# Altium project equalizer_project.PrjPcb
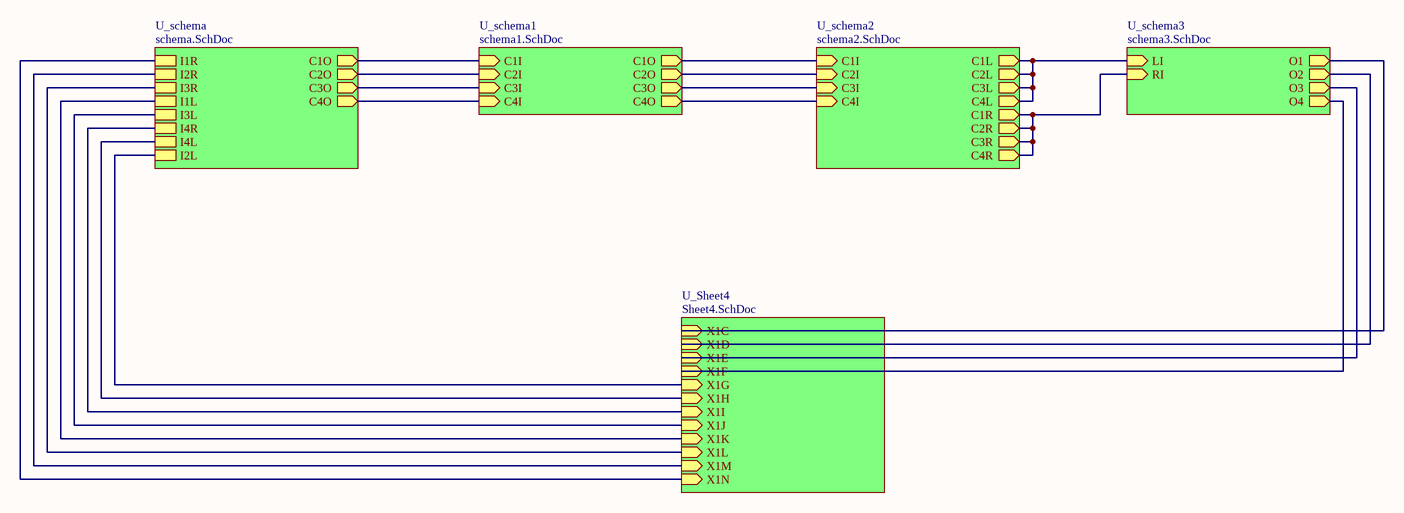
[diagram p0: top_sheet.SchDoc]
6 sheets, 224 parts. Net scope: hierarchical (ports join the sheet entries above them; power ports are global).
Board file: eq.PcbDoc
Sheets:
  top_sheet.SchDoc
    U_Sheet4 = Sheet4.SchDoc
    U_schema = schema.SchDoc
    U_schema1 = schema1.SchDoc
    U_schema2 = schema2.SchDoc
    U_schema3 = schema3.SchDoc

## Sheet top_sheet.SchDoc
size A4

### Sub-sheets
U_schema = schema.SchDoc: C1O (out), C2O (out), C3O (out), C4O (out), I1R, I2R, I3R, I1L, I3L, I4R, I4L, I2L
U_schema1 = schema1.SchDoc: C1I (in), C2I (in), C3I (in), C4I (in), C1O (out), C2O (out), C4O (out), C3O (out)
U_schema2 = schema2.SchDoc: C1I (in), C2I (in), C3I (in), C4I (in), C1L (out), C1R (out), C2L (out), C2R (out), C3L (out), C3R (out), C4L (out), C4R (out)
U_schema3 = schema3.SchDoc: LI (in), RI (in), O1 (out), O2 (out), O3 (out), O4 (out)
U_Sheet4 = Sheet4.SchDoc: X1C (in), X1D (in), X1E (in), X1F (in), X1G (in), X1H (in), X1I (in), X1J (in), X1K (in), X1L (in), X1M (in), X1N (in)

### Nets
Net2514-_3: sheet U_Sheet4/X1C, sheet U_schema3/O1
Net2514-_H4: sheet U_Sheet4/X1D, sheet U_schema3/O2
Net2514-_H5: sheet U_Sheet4/X1E, sheet U_schema3/O3
Net2514-_H6: sheet U_Sheet4/X1F, sheet U_schema3/O4
Net2514-_H7: sheet U_Sheet4/X1G, sheet U_schema/I2L
Net2514-_H8: sheet U_Sheet4/X1H, sheet U_schema/I4L
Net2514-_H9: sheet U_Sheet4/X1I, sheet U_schema/I4R
Net2514-_H10: sheet U_Sheet4/X1J, sheet U_schema/I3L
Net2514-_H11: sheet U_Sheet4/X1K, sheet U_schema/I1L
Net2514-_H12: sheet U_Sheet4/X1L, sheet U_schema/I3R
Net2514-_H13: sheet U_Sheet4/X1M, sheet U_schema/I2R
Net2514-_H14: sheet U_Sheet4/X1N, sheet U_schema/I1R
NetR53_2: sheet U_schema/C1O, sheet U_schema1/C1I
NetR54_2: sheet U_schema/C2O, sheet U_schema1/C2I
NetR55_2: sheet U_schema/C3O, sheet U_schema1/C3I
NetR56_2: sheet U_schema/C4O, sheet U_schema1/C4I
NetR85_2: sheet U_schema1/C1O, sheet U_schema2/C1I
NetR88_2: sheet U_schema1/C2O, sheet U_schema2/C2I
NetR91_2: sheet U_schema1/C3O, sheet U_schema2/C3I
NetR94_2: sheet U_schema1/C4O, sheet U_schema2/C4I
NetR117_2: sheet U_schema2/C1L, sheet U_schema2/C2L, sheet U_schema2/C3L, sheet U_schema2/C4L, sheet U_schema3/LI
NetR118_2: sheet U_schema2/C1R, sheet U_schema2/C2R, sheet U_schema2/C3R, sheet U_schema2/C4R, sheet U_schema3/RI

## Sheet Sheet4.SchDoc
size A4
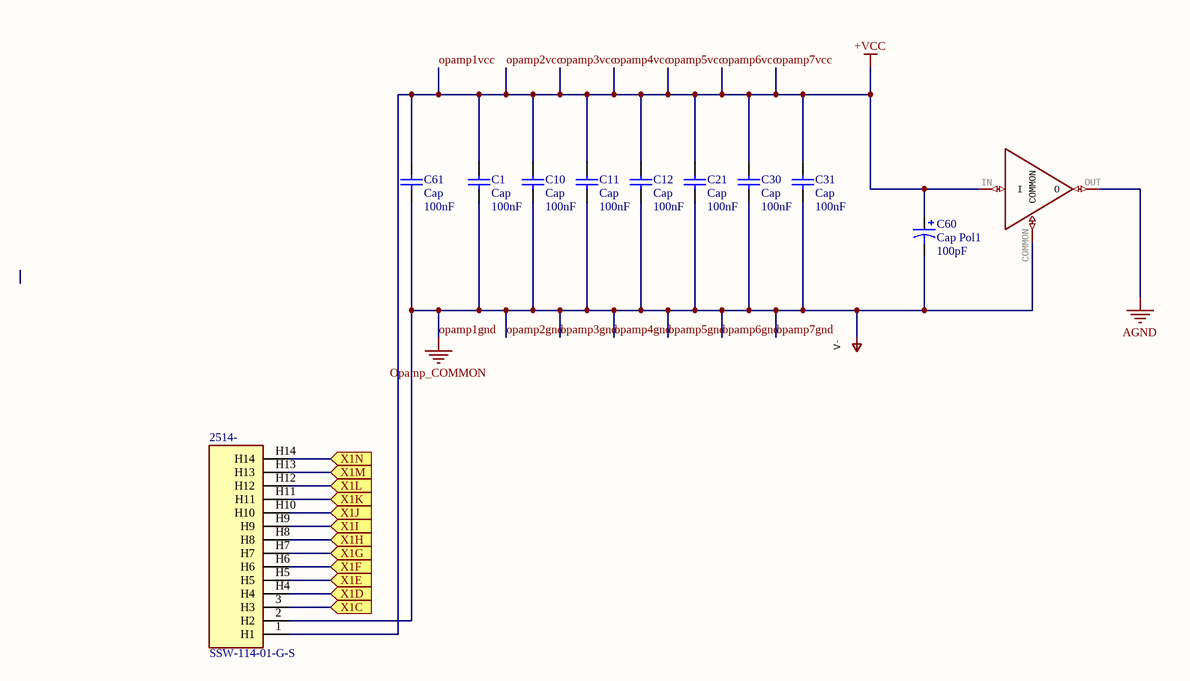
[diagram p1: Sheet4.SchDoc]

### Parts
2514-  SSW-114-01-G-S  [SHDR14W79P0X254_1X14_3607X241X851P]
C1  Cap  value 100nF  [SMD_CAPACITOR]
C10  Cap  value 100nF  [SMD_CAPACITOR]
C11  Cap  value 100nF  [SMD_CAPACITOR]
C12  Cap  value 100nF  [SMD_CAPACITOR]
C21  Cap  value 100nF  [SMD_CAPACITOR]
C30  Cap  value 100nF  [SMD_CAPACITOR]
C31  Cap  value 100nF  [SMD_CAPACITOR]
C60  Cap Pol1  value 100pF  [SMD_POLAR_CAPACITOR]
C61  Cap  value 100nF  [SMD_CAPACITOR]
P-25  V-
U?  TLE2426  [SOIC127P600X175-8N]  (value not drawn)

### Ports
X1C (in), X1D (in), X1E (in), X1F (in), X1G (in), X1H (in), X1I (in), X1J (in), X1K (in), X1L (in), X1M (in), X1N (in)

### Nets
AGND: U?.OUT(O)
opamp1gnd: 2514-.2(H2) C1.1 C10.1 C11.1 C12.1 C21.1 C30.1 C31.1 C60.2 C61.1 P-25.?1(V-) U?.COMMON  [also labelled opamp2gnd, opamp3gnd, opamp4gnd, opamp5gnd, opamp6gnd, opamp7gnd, Opamp_COMMON]
opamp1vcc: 2514-.1(H1) C1.2 C10.2 C11.2 C12.2 C21.2 C30.2 C31.2 C60.1 C61.2 U?.IN(I)  [also labelled +VCC, opamp2vcc, opamp3vcc, opamp4vcc, opamp5vcc, opamp6vcc, opamp7vcc]
Net2514-_3: 2514-.3(H3) ; port X1C
Net2514-_H4: 2514-.H4 ; port X1D
Net2514-_H5: 2514-.H5 ; port X1E
Net2514-_H6: 2514-.H6 ; port X1F
Net2514-_H7: 2514-.H7 ; port X1G
Net2514-_H8: 2514-.H8 ; port X1H
Net2514-_H9: 2514-.H9 ; port X1I
Net2514-_H10: 2514-.H10 ; port X1J
Net2514-_H11: 2514-.H11 ; port X1K
Net2514-_H12: 2514-.H12 ; port X1L
Net2514-_H13: 2514-.H13 ; port X1M
Net2514-_H14: 2514-.H14 ; port X1N

### Library data of the parts
2514- = SSW-114-01-G-S: Capacitor; Manufacturer_Name: SAMTEC; Datasheet Link: http://suddendocs.samtec.com/prints/ssw-1xx-xx-xxx-x-xx-xxx-xx-mkt.pdf; Height: 8.51mm; Manufacturer_Part_Number: SSW-114-01-G-S
C1 C10-C12 C21 C30 C31 C61 = Cap: Capacitor; Published: 8-Jun-2000; LatestRevisionDate: 17-Jul-2002; LatestRevisionNote: Re-released for DXP Platform.; PackageReference: RAD-0.3; Publisher: Altium Limited; PackageDescription: Radial Cap, Thru-Hole; 2 Leads; 0.3 in Pin Spacing
C60 = Cap Pol1: Polarized Capacitor (Radial); Published: 8-Jun-2000; LatestRevisionDate: 17-Jul-2002; LatestRevisionNote: Re-released for DXP Platform.; PackageReference: RB7.6-15; Publisher: Altium Limited; PackageDescription: Polarized Capacitor (Radial); 2 Leads
P-25 = V-: SUPPLY SYMBOL; GateName_1: 1; SymbolName_1: V-; LibraryName: supply1; DeviceSetName: V-
U? = TLE2426: GateName_1: G$1; SymbolName_1: TLE2426; LibraryName: MyLib_SD; DeviceSetName: TLE2426

## Sheet schema.SchDoc
size A3
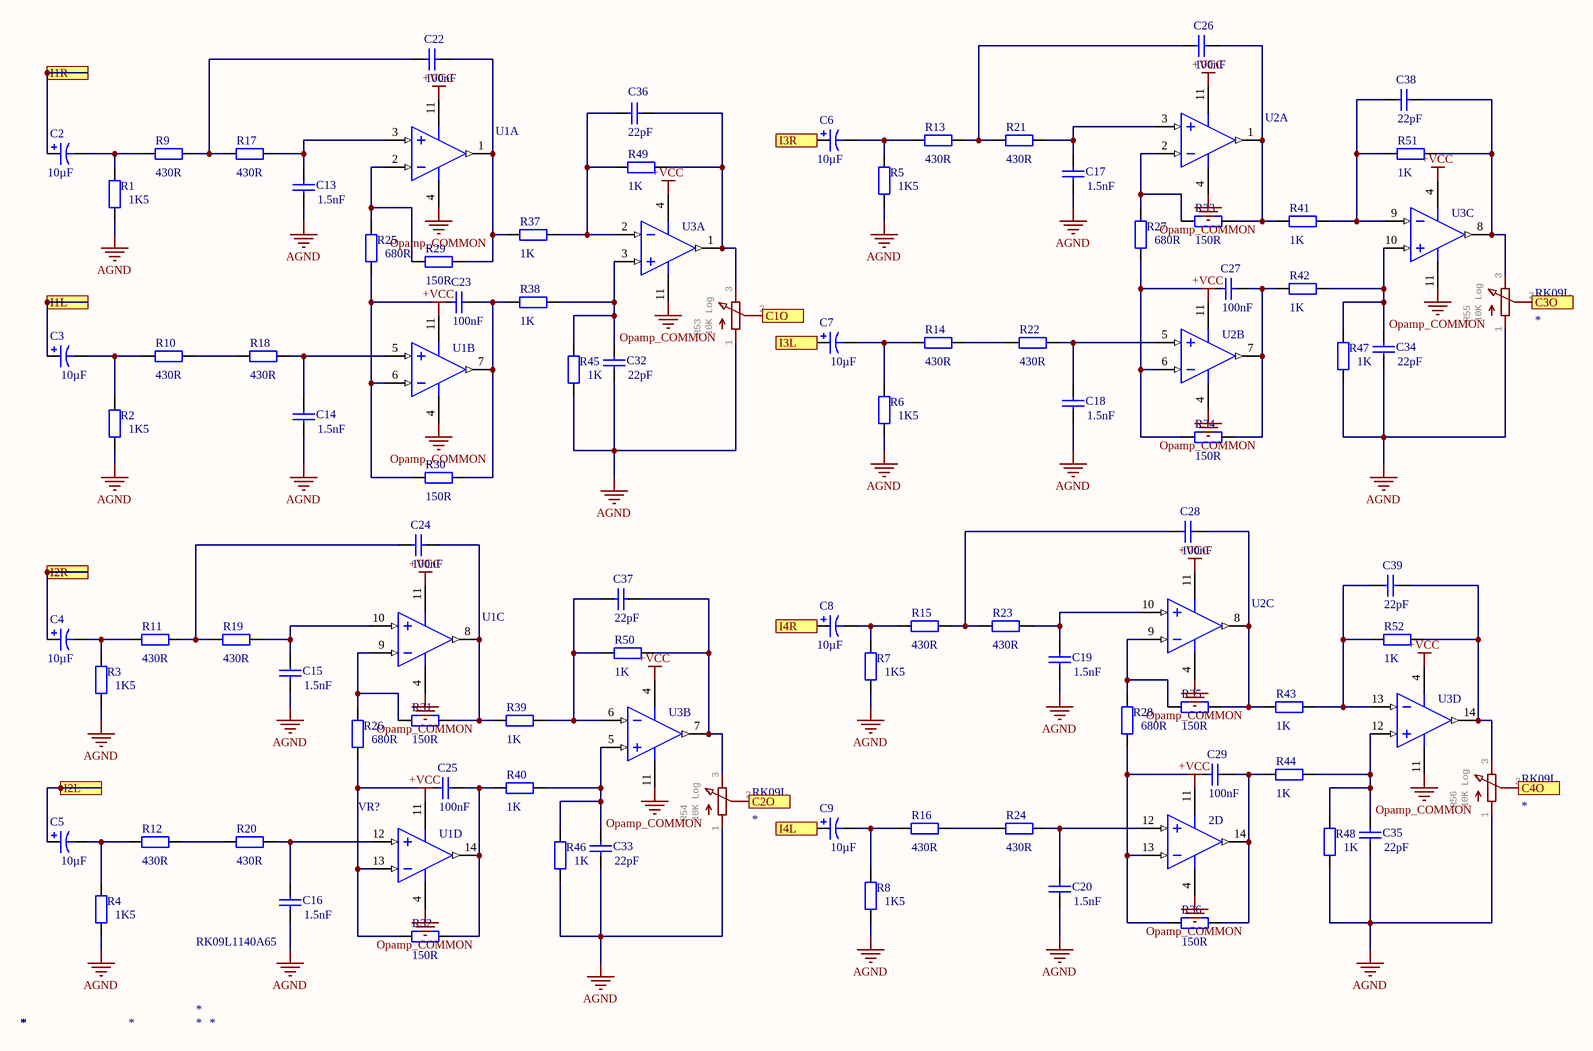
[diagram p2: schema.SchDoc]

### Parts
(Parts that share a designator on the sheet are numbered #1, #2 ... from top to bottom, then left to right.)
2  OPA1664AIDR  [OPA1664AIDR]  (value not drawn)  (part D of 4)
C2  value 10µF  [SMD_POLAR_CAPACITOR]  (hidden comment: Cap Pol1)
C3  value 10µF  [SMD_POLAR_CAPACITOR]  (hidden comment: Cap Pol1)
C4  value 10µF  [SMD_POLAR_CAPACITOR]  (hidden comment: Cap Pol1)
C5  value 10µF  [SMD_POLAR_CAPACITOR]  (hidden comment: Cap Pol1)
C6  value 10µF  [SMD_POLAR_CAPACITOR]  (hidden comment: Cap Pol1)
C7  value 10µF  [SMD_POLAR_CAPACITOR]  (hidden comment: Cap Pol1)
C8  value 10µF  [SMD_POLAR_CAPACITOR]  (hidden comment: Cap Pol1)
C9  value 10µF  [SMD_POLAR_CAPACITOR]  (hidden comment: Cap Pol1)
C13  value 1.5nF  [SMD_CAPACITOR]  (hidden comment: Cap)
C14  value 1.5nF  [SMD_CAPACITOR]  (hidden comment: Cap)
C15  value 1.5nF  [SMD_CAPACITOR]  (hidden comment: Cap)
C16  value 1.5nF  [SMD_CAPACITOR]  (hidden comment: Cap)
C17  value 1.5nF  [SMD_CAPACITOR]  (hidden comment: Cap)
C18  value 1.5nF  [SMD_CAPACITOR]  (hidden comment: Cap)
C19  value 1.5nF  [SMD_CAPACITOR]  (hidden comment: Cap)
C20  value 1.5nF  [SMD_CAPACITOR]  (hidden comment: Cap)
C22  value 100nF  [SMD_CAPACITOR]  (hidden comment: Cap)
C23  value 100nF  [SMD_CAPACITOR]  (hidden comment: Cap)
C24  value 100nF  [SMD_CAPACITOR]  (hidden comment: Cap)
C25  value 100nF  [SMD_CAPACITOR]  (hidden comment: Cap)
C26  value 100nF  [SMD_CAPACITOR]  (hidden comment: Cap)
C27  value 100nF  [SMD_CAPACITOR]  (hidden comment: Cap)
C28  value 100nF  [SMD_CAPACITOR]  (hidden comment: Cap)
C29  value 100nF  [SMD_CAPACITOR]  (hidden comment: Cap)
C32  value 22pF  [SMD_CAPACITOR]  (hidden comment: Cap)
C33  value 22pF  [SMD_CAPACITOR]  (hidden comment: Cap)
C34  value 22pF  [SMD_CAPACITOR]  (hidden comment: Cap)
C35  value 22pF  [SMD_CAPACITOR]  (hidden comment: Cap)
C36  value 22pF  [SMD_CAPACITOR]  (hidden comment: Cap)
C37  value 22pF  [SMD_CAPACITOR]  (hidden comment: Cap)
C38  value 22pF  [SMD_CAPACITOR]  (hidden comment: Cap)
C39  value 22pF  [SMD_CAPACITOR]  (hidden comment: Cap)
R1  value 1K5  [SMD_RESISTOR]  (hidden comment: Res2)
R2  value 1K5  [SMD_RESISTOR]  (hidden comment: Res2)
R3  value 1K5  [SMD_RESISTOR]  (hidden comment: Res2)
R4  value 1K5  [SMD_RESISTOR]  (hidden comment: Res2)
R5  value 1K5  [SMD_RESISTOR]  (hidden comment: Res2)
R6  value 1K5  [SMD_RESISTOR]  (hidden comment: Res2)
R7  value 1K5  [SMD_RESISTOR]  (hidden comment: Res2)
R8  value 1K5  [SMD_RESISTOR]  (hidden comment: Res2)
R9  value 430R  [SMD_RESISTOR]  (hidden comment: Res2)
R10  value 430R  [SMD_RESISTOR]  (hidden comment: Res2)
R11  value 430R  [SMD_RESISTOR]  (hidden comment: Res2)
R12  value 430R  [SMD_RESISTOR]  (hidden comment: Res2)
R13  value 430R  [SMD_RESISTOR]  (hidden comment: Res2)
R14  value 430R  [SMD_RESISTOR]  (hidden comment: Res2)
R15  value 430R  [SMD_RESISTOR]  (hidden comment: Res2)
R16  value 430R  [SMD_RESISTOR]  (hidden comment: Res2)
R17  value 430R  [SMD_RESISTOR]  (hidden comment: Res2)
R18  value 430R  [SMD_RESISTOR]  (hidden comment: Res2)
R19  value 430R  [SMD_RESISTOR]  (hidden comment: Res2)
R20  value 430R  [SMD_RESISTOR]  (hidden comment: Res2)
R21  value 430R  [SMD_RESISTOR]  (hidden comment: Res2)
R22  value 430R  [SMD_RESISTOR]  (hidden comment: Res2)
R23  value 430R  [SMD_RESISTOR]  (hidden comment: Res2)
R24  value 430R  [SMD_RESISTOR]  (hidden comment: Res2)
R25  value 680R  [SMD_RESISTOR]  (hidden comment: Res2)
R26  value 680R  [SMD_RESISTOR]  (hidden comment: Res2)
R27  value 680R  [SMD_RESISTOR]  (hidden comment: Res2)
R28  value 680R  [SMD_RESISTOR]  (hidden comment: Res2)
R29  value 150R  [SMD_RESISTOR]  (hidden comment: Res2)
R30  value 150R  [SMD_RESISTOR]  (hidden comment: Res2)
R31  value 150R  [SMD_RESISTOR]  (hidden comment: Res2)
R32  value 150R  [SMD_RESISTOR]  (hidden comment: Res2)
R33  value 150R  [SMD_RESISTOR]  (hidden comment: Res2)
R34  value 150R  [SMD_RESISTOR]  (hidden comment: Res2)
R35  value 150R  [SMD_RESISTOR]  (hidden comment: Res2)
R36  value 150R  [SMD_RESISTOR]  (hidden comment: Res2)
R37  value 1K  [SMD_RESISTOR]  (hidden comment: Res2)
R38  value 1K  [SMD_RESISTOR]  (hidden comment: Res2)
R39  value 1K  [SMD_RESISTOR]  (hidden comment: Res2)
R40  value 1K  [SMD_RESISTOR]  (hidden comment: Res2)
R41  value 1K  [SMD_RESISTOR]  (hidden comment: Res2)
R42  value 1K  [SMD_RESISTOR]  (hidden comment: Res2)
R43  value 1K  [SMD_RESISTOR]  (hidden comment: Res2)
R44  value 1K  [SMD_RESISTOR]  (hidden comment: Res2)
R45  value 1K  [SMD_RESISTOR]  (hidden comment: Res2)
R46  value 1K  [SMD_RESISTOR]  (hidden comment: Res2)
R47  value 1K  [SMD_RESISTOR]  (hidden comment: Res2)
R48  value 1K  [SMD_RESISTOR]  (hidden comment: Res2)
R49  value 1K  [SMD_RESISTOR]  (hidden comment: Res2)
R50  value 1K  [SMD_RESISTOR]  (hidden comment: Res2)
R51  value 1K  [SMD_RESISTOR]  (hidden comment: Res2)
R52  value 1K  [SMD_RESISTOR]  (hidden comment: Res2)
R53  value 10K Log  [RK09L1140A65]
R54  value 10K Log  [RK09L1140A65]
R55  value 10K Log  [RK09L1140A65]
R56  value 10K Log  [RK09L1140A65]
U1  OPA1664AIDR  [OPA1664AIDR]  (value not drawn)  (parts A,B,C,D of 4)
U2  OPA1664AIDR  [OPA1664AIDR]  (value not drawn)  (parts A,B,C of 4)
U3  OPA1664AIDR  [OPA1664AIDR]  (value not drawn)  (parts A,B,C,D of 4)
VR?#1  RK09L1140A65  [RK09L1140A65]

### Ports
C1O (out), C2O (out), C3O (out), C4O (out), I1L, I1R, I2L, I2R, I3L, I3R, I4L, I4R

### Nets
+VCC: 2.11(V-) U1.11(V-) U2.11(V-) U3.4(V+)  [project net opamp1vcc]
AGND: C13.1 C14.1 C15.1 C16.1 C17.1 C18.1 C19.1 C20.1 C32.1 C33.1 C34.1 C35.1 R1.1 R2.1 R3.1 R4.1 R5.1 R6.1 R7.1 R8.1 R45.1 R46.1 R47.1 R48.1 R53.1 R54.1 R55.1 R56.1
Opamp_COMMON: 2.4(V+) U1.4(V+) U2.4(V+) U3.11(V-)  [project net opamp1gnd]
Net2_12: 2.12(IN_D+) C20.2 R24.2
Net2_13: 2.13(IN_D-) C29.1 R28.1 R36.1
Net2_14: 2.14(OUT_D) C29.2 R36.2 R44.1
Net2514-_H7: C5.1 ; port I2L
Net2514-_H8: C9.1 ; port I4L
Net2514-_H9: C8.1 ; port I4R
Net2514-_H10: C7.1 ; port I3L
Net2514-_H11: C3.1 ; port I1L
Net2514-_H12: C6.1 ; port I3R
Net2514-_H13: C4.1 ; port I2R
Net2514-_H14: C2.1 ; port I1R
NetC2_2: C2.2 R1.2 R9.1
NetC3_2: C3.2 R2.2 R10.1
NetC4_2: C4.2 R3.2 R11.1
NetC5_2: C5.2 R4.2 R12.1
NetC6_2: C6.2 R5.2 R13.1
NetC7_2: C7.2 R6.2 R14.1
NetC8_2: C8.2 R7.2 R15.1
NetC9_2: C9.2 R8.2 R16.1
NetC13_2: C13.2 R17.2 U1.3(IN_A+)
NetC14_2: C14.2 R18.2 U1.5(IN_B+)
NetC15_2: C15.2 R19.2 U1.10(IN_C+)
NetC16_2: C16.2 R20.2 U1.12(IN_D+)
NetC17_2: C17.2 R21.2 U2.3(IN_A+)
NetC18_2: C18.2 R22.2 U2.5(IN_B+)
NetC19_2: C19.2 R23.2 U2.10(IN_C+)
NetC22_1: C22.1 R9.2 R17.1
NetC22_2: C22.2 R29.2 R37.1 U1.1(OUT_A)
NetC23_1: C23.1 R25.1 R30.1 U1.6(IN_B-)
NetC23_2: C23.2 R30.2 R38.1 U1.7(OUT_B)
NetC24_1: C24.1 R11.2 R19.1
NetC24_2: C24.2 R31.2 R39.1 U1.8(OUT_C)
NetC25_1: C25.1 R26.1 R32.1 U1.13(IN_D-)
NetC25_2: C25.2 R32.2 R40.1 U1.14(OUT_D)
NetC26_1: C26.1 R13.2 R21.1
NetC26_2: C26.2 R33.2 R41.1 U2.1(OUT_A)
NetC27_1: C27.1 R27.1 R34.1 U2.6(IN_B-)
NetC27_2: C27.2 R34.2 R42.1 U2.7(OUT_B)
NetC28_1: C28.1 R15.2 R23.1
NetC28_2: C28.2 R35.2 R43.1 U2.8(OUT_C)
NetC32_2: C32.2 R38.2 R45.2 U3.3(IN_A+)
NetC33_2: C33.2 R40.2 R46.2 U3.5(IN_B+)
NetC34_2: C34.2 R42.2 R47.2 U3.10(IN_C+)
NetC35_2: C35.2 R44.2 R48.2 U3.12(IN_D+)
NetC36_1: C36.1 R37.2 R49.1 U3.2(IN_A-)
NetC36_2: C36.2 R49.2 R53.3 U3.1(OUT_A)
NetC37_1: C37.1 R39.2 R50.1 U3.6(IN_B-)
NetC37_2: C37.2 R50.2 R54.3 U3.7(OUT_B)
NetC38_1: C38.1 R41.2 R51.1 U3.9(IN_C-)
NetC38_2: C38.2 R51.2 R55.3 U3.8(OUT_C)
NetC39_1: C39.1 R43.2 R52.1 U3.13(IN_D-)
NetC39_2: C39.2 R52.2 R56.3 U3.14(OUT_D)
NetR10_2: R10.2 R18.1
NetR12_2: R12.2 R20.1
NetR14_2: R14.2 R22.1
NetR16_2: R16.2 R24.1
NetR25_2: R25.2 R29.1 U1.2(IN_A-)
NetR26_2: R26.2 R31.1 U1.9(IN_C-)
NetR27_2: R27.2 R33.1 U2.2(IN_A-)
NetR28_2: R28.2 R35.1 U2.9(IN_C-)
NetR53_2: R53.2 ; port C1O
NetR54_2: R54.2 ; port C2O
NetR55_2: R55.2 ; port C3O
NetR56_2: R56.2 ; port C4O

### Library data of the parts
2 U1-U3 = CMP-0272-00211-3: Sound Plus Low-Power, Low-Noise and Distortion, Audio Operational Amplifier, 3 to 36 V, -40 to 85 degC, 14-pin SOIC (D14), Green (RoHS & no Sb/Br); Manufacturer: Texas Instruments; Iq per channel(Max)(mA): 1.5; IIB(Max)(pA): 1200000; Offset Drift(Typ)(uV/C): 2; Total Supply Voltage(Max)(+5V is 5, +/-5V is 10): 36; Rating: Catalog; Packing: LARGE T&R; Slew Rate(Typ)(V/us): 17; CMRR(Min)(dB): 106; Total Supply Voltage(Min)(+5V is 5, +/-5V is 10): 3; Sub Family: Audio Operational Amplifier, High Supply Voltage Amplifier (>=30V), Low Noise Amp (<=10nV/rtHz), Precision Amplifier; GBW(Typ)(MHz): 22; Number of Channels: 4; Code_JEDEC: MS-012; PartNumber: OPA1664AIDR; ComponentLink2Description: Datasheet; ComponentLink3URL: http://www.ti.com/lit/ml/mpds177g/mpds177g.pdf; PackageVersion: 4040047-5/M, 06/2011; ComponentLink1Description: Manufacturer URL; DatasheetVersion: SBOS489; Mounting Technology: Surface Mount; Vio (25C)(Max)(mV): 1.5; PackageReference: D0014A; ComponentLink1URL: http://www.ti.com/; ComponentLink2URL: http://www.ti.com/lit/ds/symlink/opa1664.pdf; Eco-Plan: Green (RoHS & no Sb/Br); PackageDescription: 14-Pin Plastic Small Outline, Body 8.65 x 3.9 mm, Pitch 1.27 mm; ComponentLink3Description: Package Specification
C2-C9 = Cap Pol1: Polarized Capacitor (Radial); Published: 8-Jun-2000; LatestRevisionDate: 17-Jul-2002; LatestRevisionNote: Re-released for DXP Platform.; PackageReference: RB7.6-15; Publisher: Altium Limited; PackageDescription: Polarized Capacitor (Radial); 2 Leads
C13-C20 C22-C29 C32-C39 = Cap: Capacitor; Published: 8-Jun-2000; LatestRevisionDate: 17-Jul-2002; LatestRevisionNote: Re-released for DXP Platform.; PackageReference: RAD-0.3; Publisher: Altium Limited; PackageDescription: Radial Cap, Thru-Hole; 2 Leads; 0.3 in Pin Spacing
R1-R52 = Res2: Resistor; Published: 8-Jun-2000; LatestRevisionDate: 17-Jul-2002; LatestRevisionNote: Re-released for DXP Platform.; PackageReference: AXIAL-0.4; Publisher: Altium Limited; PackageDescription: Axial Device, Thru-Hole; 2 Leads; 0.4 in Pin Spacing
R53-R56 = RK09L: GateName_1: G$1; SymbolName_1: POT_EU-; LibraryName: SD_Pots; DeviceSetName: RK09L
VR?#1 = RK09L1140A65: Variable Resistor; Manufacturer_Name: ALPS; Datasheet Link: https://componentsearchengine.com/Datasheets/1/RK09L1140A65.pdf; Height: 35mm; Mouser2 Part Number: 688-RK09L1140A65; Mouser2 Price/Stock: https://www.mouser.com/Search/Refine.aspx?Keyword=688-RK09L1140A65; Manufacturer_Part_Number: RK09L1140A65

## Sheet schema1.SchDoc
size A4
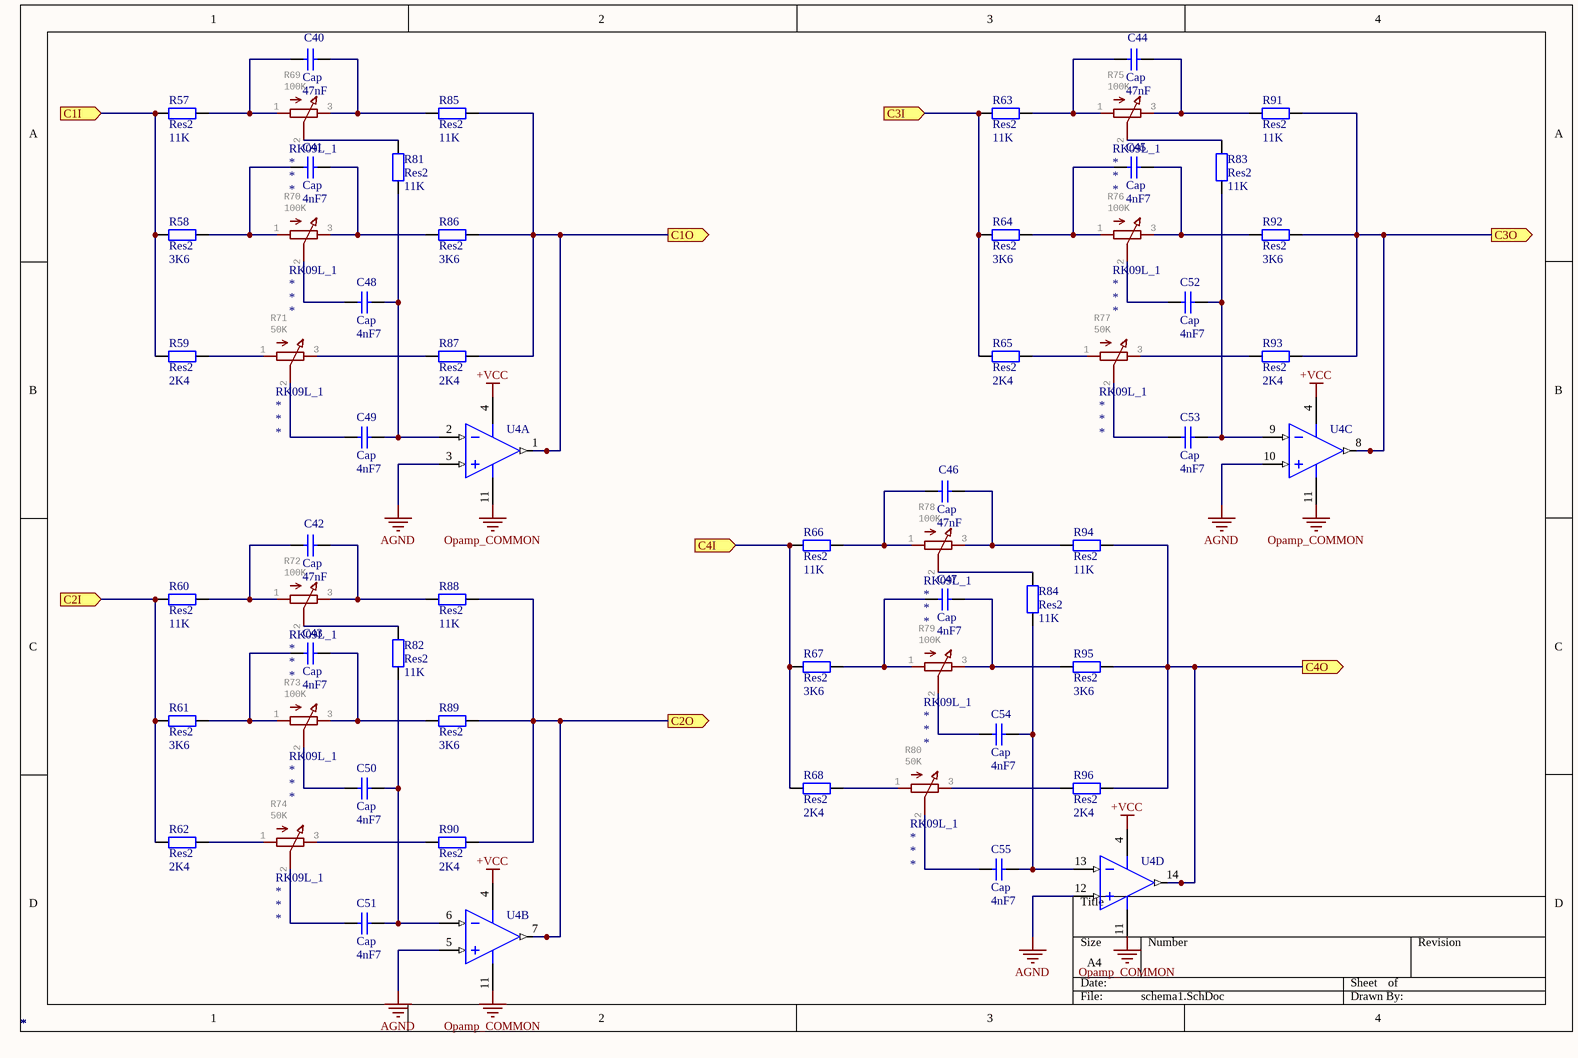
[diagram p3: schema1.SchDoc]

### Parts
C40  Cap  value 47nF  [SMD_CAPACITOR]
C41  Cap  value 4nF7  [SMD_CAPACITOR]
C42  Cap  value 47nF  [SMD_CAPACITOR]
C43  Cap  value 4nF7  [SMD_CAPACITOR]
C44  Cap  value 47nF  [SMD_CAPACITOR]
C45  Cap  value 4nF7  [SMD_CAPACITOR]
C46  Cap  value 47nF  [SMD_CAPACITOR]
C47  Cap  value 4nF7  [SMD_CAPACITOR]
C48  Cap  value 4nF7  [SMD_CAPACITOR]
C49  Cap  value 4nF7  [SMD_CAPACITOR]
C50  Cap  value 4nF7  [SMD_CAPACITOR]
C51  Cap  value 4nF7  [SMD_CAPACITOR]
C52  Cap  value 4nF7  [SMD_CAPACITOR]
C53  Cap  value 4nF7  [SMD_CAPACITOR]
C54  Cap  value 4nF7  [SMD_CAPACITOR]
C55  Cap  value 4nF7  [SMD_CAPACITOR]
R57  Res2  value 11K  [SMD_RESISTOR]
R58  Res2  value 3K6  [SMD_RESISTOR]
R59  Res2  value 2K4  [SMD_RESISTOR]
R60  Res2  value 11K  [SMD_RESISTOR]
R61  Res2  value 3K6  [SMD_RESISTOR]
R62  Res2  value 2K4  [SMD_RESISTOR]
R63  Res2  value 11K  [SMD_RESISTOR]
R64  Res2  value 3K6  [SMD_RESISTOR]
R65  Res2  value 2K4  [SMD_RESISTOR]
R66  Res2  value 11K  [SMD_RESISTOR]
R67  Res2  value 3K6  [SMD_RESISTOR]
R68  Res2  value 2K4  [SMD_RESISTOR]
R69  value 100K  [RK09L1140A65]
R70  value 100K  [RK09L1140A65]
R71  value 50K  [RK09L1140A65]
R72  value 100K  [RK09L1140A65]
R73  value 100K  [RK09L1140A65]
R74  value 50K  [RK09L1140A65]
R75  value 100K  [RK09L1140A65]
R76  value 100K  [RK09L1140A65]
R77  value 50K  [RK09L1140A65]
R78  value 100K  [RK09L1140A65]
R79  value 100K  [RK09L1140A65]
R80  value 50K  [RK09L1140A65]
R81  Res2  value 11K  [SMD_RESISTOR]
R82  Res2  value 11K  [SMD_RESISTOR]
R83  Res2  value 11K  [SMD_RESISTOR]
R84  Res2  value 11K  [SMD_RESISTOR]
R85  Res2  value 11K  [SMD_RESISTOR]
R86  Res2  value 3K6  [SMD_RESISTOR]
R87  Res2  value 2K4  [SMD_RESISTOR]
R88  Res2  value 11K  [SMD_RESISTOR]
R89  Res2  value 3K6  [SMD_RESISTOR]
R90  Res2  value 2K4  [SMD_RESISTOR]
R91  Res2  value 11K  [SMD_RESISTOR]
R92  Res2  value 3K6  [SMD_RESISTOR]
R93  Res2  value 2K4  [SMD_RESISTOR]
R94  Res2  value 11K  [SMD_RESISTOR]
R95  Res2  value 3K6  [SMD_RESISTOR]
R96  Res2  value 2K4  [SMD_RESISTOR]
U4  OPA1664AIDR  [OPA1664AIDR]  (value not drawn)  (parts A,B,C,D of 4)

### Ports
C1I (in), C1O (out), C2I (in), C2O (out), C3I (in), C3O (out), C4I (in), C4O (out)

### Nets
+VCC: U4.4(V+)  [project net opamp1vcc]
AGND: U4.3(IN_A+) U4.5(IN_B+) U4.10(IN_C+) U4.12(IN_D+)
Opamp_COMMON: U4.11(V-)  [project net opamp1gnd]
NetC40_1: C40.1 R57.2 R69.1
NetC40_2: C40.2 R69.3 R85.1
NetC41_1: C41.1 R58.2 R70.1
NetC41_2: C41.2 R70.3 R86.1
NetC42_1: C42.1 R60.2 R72.1
NetC42_2: C42.2 R72.3 R88.1
NetC43_1: C43.1 R61.2 R73.1
NetC43_2: C43.2 R73.3 R89.1
NetC44_1: C44.1 R63.2 R75.1
NetC44_2: C44.2 R75.3 R91.1
NetC45_1: C45.1 R64.2 R76.1
NetC45_2: C45.2 R76.3 R92.1
NetC46_1: C46.1 R66.2 R78.1
NetC46_2: C46.2 R78.3 R94.1
NetC47_1: C47.1 R67.2 R79.1
NetC47_2: C47.2 R79.3 R95.1
NetC48_1: C48.1 R70.2
NetC48_2: C48.2 C49.2 R81.1 U4.2(IN_A-)
NetC49_1: C49.1 R71.2
NetC50_1: C50.1 R73.2
NetC50_2: C50.2 C51.2 R82.1 U4.6(IN_B-)
NetC51_1: C51.1 R74.2
NetC52_1: C52.1 R76.2
NetC52_2: C52.2 C53.2 R83.1 U4.9(IN_C-)
NetC53_1: C53.1 R77.2
NetC54_1: C54.1 R79.2
NetC54_2: C54.2 C55.2 R84.1 U4.13(IN_D-)
NetC55_1: C55.1 R80.2
NetR53_2: R57.1 R58.1 R59.1 ; port C1I
NetR54_2: R60.1 R61.1 R62.1 ; port C2I
NetR55_2: R63.1 R64.1 R65.1 ; port C3I
NetR56_2: R66.1 R67.1 R68.1 ; port C4I
NetR59_2: R59.2 R71.1
NetR62_2: R62.2 R74.1
NetR65_2: R65.2 R77.1
NetR68_2: R68.2 R80.1
NetR69_2: R69.2 R81.2
NetR71_3: R71.3 R87.1
NetR72_2: R72.2 R82.2
NetR74_3: R74.3 R90.1
NetR75_2: R75.2 R83.2
NetR77_3: R77.3 R93.1
NetR78_2: R78.2 R84.2
NetR80_3: R80.3 R96.1
NetR85_2: R85.2 R86.2 R87.2 U4.1(OUT_A) ; port C1O
NetR88_2: R88.2 R89.2 R90.2 U4.7(OUT_B) ; port C2O
NetR91_2: R91.2 R92.2 R93.2 U4.8(OUT_C) ; port C3O
NetR94_2: R94.2 R95.2 R96.2 U4.14(OUT_D) ; port C4O

### Library data of the parts
C40-C55 = Cap: Capacitor; Published: 8-Jun-2000; LatestRevisionDate: 17-Jul-2002; LatestRevisionNote: Re-released for DXP Platform.; PackageReference: RAD-0.3; Publisher: Altium Limited; PackageDescription: Radial Cap, Thru-Hole; 2 Leads; 0.3 in Pin Spacing
R57-R68 R81-R96 = Res2: Resistor; Published: 8-Jun-2000; LatestRevisionDate: 17-Jul-2002; LatestRevisionNote: Re-released for DXP Platform.; PackageReference: AXIAL-0.4; Publisher: Altium Limited; PackageDescription: Axial Device, Thru-Hole; 2 Leads; 0.4 in Pin Spacing
R69-R80 = RK09L_1: GateName_1: G$1; SymbolName_1: POT_EU-; DeviceSetName: RK09L; LibraryName: SD_Pots
U4 = CMP-0272-00211-3: as 2 on sheet schema; Code_JEDEC: MS-012; PartNumber: OPA1664AIDR; ComponentLink2Description: Datasheet; ComponentLink3URL: http://www.ti.com/lit/ml/mpds177g/mpds177g.pdf; PackageVersion: 4040047-5/M, 06/2011; ComponentLink1Description: Manufacturer URL; DatasheetVersion: SBOS489; Mounting Technology: Surface Mount; Vio (25C)(Max)(mV): 1.5; PackageReference: D0014A; ComponentLink1URL: http://www.ti.com/; ComponentLink2URL: http://www.ti.com/lit/ds/symlink/opa1664.pdf; Eco-Plan: Green (RoHS & no Sb/Br); PackageDescription: 14-Pin Plastic Small Outline, Body 8.65 x 3.9 mm, Pitch 1.27 mm; ComponentLink3Description: Package Specification

## Sheet schema2.SchDoc
size A4
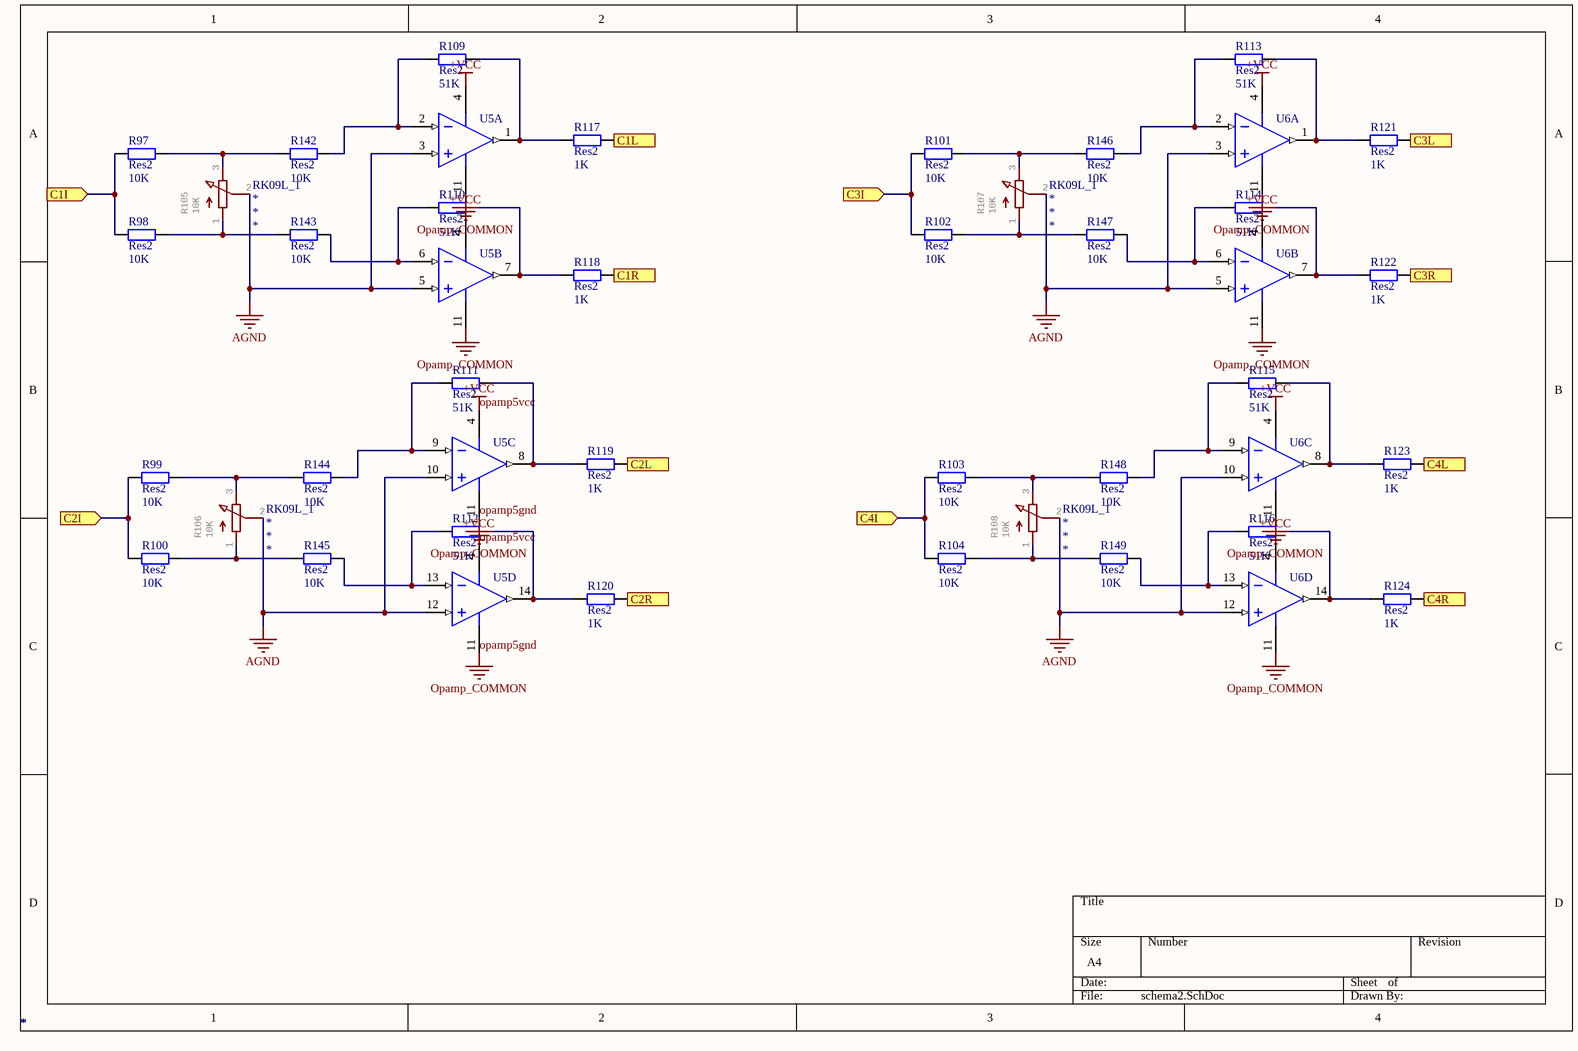
[diagram p4: schema2.SchDoc]

### Parts
R97  Res2  value 10K  [SMD_RESISTOR]
R98  Res2  value 10K  [SMD_RESISTOR]
R99  Res2  value 10K  [SMD_RESISTOR]
R100  Res2  value 10K  [SMD_RESISTOR]
R101  Res2  value 10K  [SMD_RESISTOR]
R102  Res2  value 10K  [SMD_RESISTOR]
R103  Res2  value 10K  [SMD_RESISTOR]
R104  Res2  value 10K  [SMD_RESISTOR]
R105  value 10K  [RK09L1140A65]
R106  value 10K  [RK09L1140A65]
R107  value 10K  [RK09L1140A65]
R108  value 10K  [RK09L1140A65]
R109  Res2  value 51K  [SMD_RESISTOR]
R110  Res2  value 51K  [SMD_RESISTOR]
R111  Res2  value 51K  [SMD_RESISTOR]
R112  Res2  value 51K  [SMD_RESISTOR]
R113  Res2  value 51K  [SMD_RESISTOR]
R114  Res2  value 51K  [SMD_RESISTOR]
R115  Res2  value 51K  [SMD_RESISTOR]
R116  Res2  value 51K  [SMD_RESISTOR]
R117  Res2  value 1K  [SMD_RESISTOR]
R118  Res2  value 1K  [SMD_RESISTOR]
R119  Res2  value 1K  [SMD_RESISTOR]
R120  Res2  value 1K  [SMD_RESISTOR]
R121  Res2  value 1K  [SMD_RESISTOR]
R122  Res2  value 1K  [SMD_RESISTOR]
R123  Res2  value 1K  [SMD_RESISTOR]
R124  Res2  value 1K  [SMD_RESISTOR]
R142  Res2  value 10K  [SMD_RESISTOR]
R143  Res2  value 10K  [SMD_RESISTOR]
R144  Res2  value 10K  [SMD_RESISTOR]
R145  Res2  value 10K  [SMD_RESISTOR]
R146  Res2  value 10K  [SMD_RESISTOR]
R147  Res2  value 10K  [SMD_RESISTOR]
R148  Res2  value 10K  [SMD_RESISTOR]
R149  Res2  value 10K  [SMD_RESISTOR]
U5  OPA1664AIDR  [OPA1664AIDR]  (value not drawn)  (parts A,B,C,D of 4)
U6  OPA1664AIDR  [OPA1664AIDR]  (value not drawn)  (parts A,B,C,D of 4)

### Ports
C1I (in), C1L (out), C1R (out), C2I (in), C2L (out), C2R (out), C3I (in), C3L (out), C3R (out), C4I (in), C4L (out), C4R (out)

### Nets
+VCC: U5.4(V+) U6.4(V+)  [also labelled opamp5vcc]  [project net opamp1vcc]
AGND: R105.2 R106.2 R107.2 R108.2 U5.3(IN_A+) U5.5(IN_B+) U5.10(IN_C+) U5.12(IN_D+) U6.3(IN_A+) U6.5(IN_B+) U6.10(IN_C+) U6.12(IN_D+)
opamp5gnd: U5.11(V-) U6.11(V-)  [also labelled Opamp_COMMON]  [project net opamp1gnd]
NetR85_2: R97.1 R98.1 ; port C1I
NetR88_2: R99.1 R100.1 ; port C2I
NetR91_2: R101.1 R102.1 ; port C3I
NetR94_2: R103.1 R104.1 ; port C4I
NetR97_2: R97.2 R105.3 R142.1
NetR98_2: R98.2 R105.1 R143.1
NetR99_2: R99.2 R106.3 R144.1
NetR100_2: R100.2 R106.1 R145.1
NetR101_2: R101.2 R107.3 R146.1
NetR102_2: R102.2 R107.1 R147.1
NetR103_2: R103.2 R108.3 R148.1
NetR104_2: R104.2 R108.1 R149.1
NetR109_1: R109.1 R142.2 U5.2(IN_A-)
NetR109_2: R109.2 R117.1 U5.1(OUT_A)
NetR110_1: R110.1 R143.2 U5.6(IN_B-)
NetR110_2: R110.2 R118.1 U5.7(OUT_B)
NetR111_1: R111.1 R144.2 U5.9(IN_C-)
NetR111_2: R111.2 R119.1 U5.8(OUT_C)
NetR112_1: R112.1 R145.2 U5.13(IN_D-)
NetR112_2: R112.2 R120.1 U5.14(OUT_D)
NetR113_1: R113.1 R146.2 U6.2(IN_A-)
NetR113_2: R113.2 R121.1 U6.1(OUT_A)
NetR114_1: R114.1 R147.2 U6.6(IN_B-)
NetR114_2: R114.2 R122.1 U6.7(OUT_B)
NetR115_1: R115.1 R148.2 U6.9(IN_C-)
NetR115_2: R115.2 R123.1 U6.8(OUT_C)
NetR116_1: R116.1 R149.2 U6.13(IN_D-)
NetR116_2: R116.2 R124.1 U6.14(OUT_D)
NetR117_2: R117.2 R119.2 R121.2 R123.2 ; port C1L, port C2L, port C3L, port C4L
NetR118_2: R118.2 R120.2 R122.2 R124.2 ; port C1R, port C2R, port C3R, port C4R

### Library data of the parts
R97-R104 R109-R124 R142-R149 = Res2: Resistor; Published: 8-Jun-2000; LatestRevisionDate: 17-Jul-2002; LatestRevisionNote: Re-released for DXP Platform.; PackageReference: AXIAL-0.4; Publisher: Altium Limited; PackageDescription: Axial Device, Thru-Hole; 2 Leads; 0.4 in Pin Spacing
R105-R108 = RK09L_1: as R69 on sheet schema1; LibraryName: SD_Pots
U5 U6 = CMP-0272-00211-3: as 2 on sheet schema; Code_JEDEC: MS-012; PartNumber: OPA1664AIDR; ComponentLink2Description: Datasheet; ComponentLink3URL: http://www.ti.com/lit/ml/mpds177g/mpds177g.pdf; PackageVersion: 4040047-5/M, 06/2011; ComponentLink1Description: Manufacturer URL; DatasheetVersion: SBOS489; Mounting Technology: Surface Mount; Vio (25C)(Max)(mV): 1.5; PackageReference: D0014A; ComponentLink1URL: http://www.ti.com/; ComponentLink2URL: http://www.ti.com/lit/ds/symlink/opa1664.pdf; Eco-Plan: Green (RoHS & no Sb/Br); PackageDescription: 14-Pin Plastic Small Outline, Body 8.65 x 3.9 mm, Pitch 1.27 mm; ComponentLink3Description: Package Specification

## Sheet schema3.SchDoc
size A4
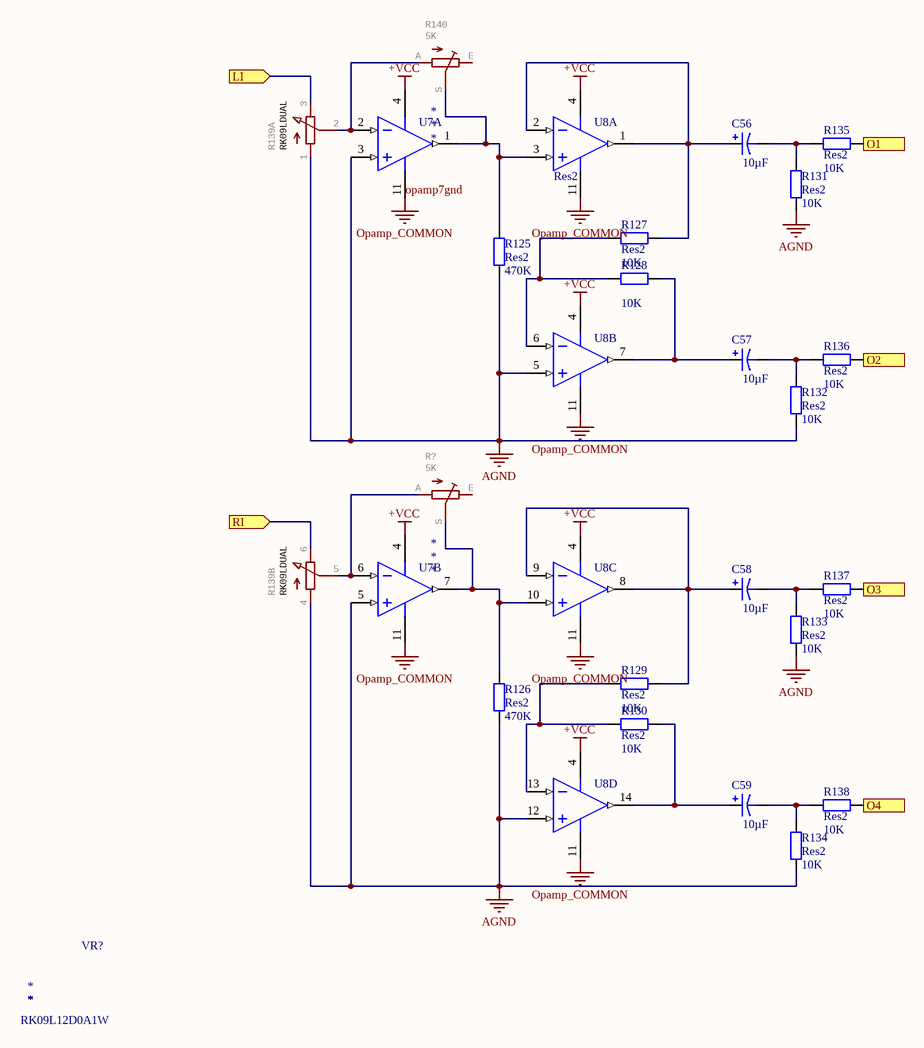
[diagram p5: schema3.SchDoc]

### Parts
(Parts that share a designator on the sheet are numbered #1, #2 ... from top to bottom, then left to right.)
C56  value 10µF  [SMD_POLAR_CAPACITOR]  (hidden comment: Cap Pol1)
C57  value 10µF  [SMD_POLAR_CAPACITOR]  (hidden comment: Cap Pol1)
C58  value 10µF  [SMD_POLAR_CAPACITOR]  (hidden comment: Cap Pol1)
C59  value 10µF  [SMD_POLAR_CAPACITOR]  (hidden comment: Cap Pol1)
R125  Res2  value 470K  [SMD_RESISTOR]
R126  Res2  value 470K  [SMD_RESISTOR]
R127  Res2  value 10K  [SMD_RESISTOR]
R128  Res2  value 10K  [SMD_RESISTOR]
R129  Res2  value 10K  [SMD_RESISTOR]
R130  Res2  value 10K  [SMD_RESISTOR]
R131  Res2  value 10K  [SMD_RESISTOR]
R132  Res2  value 10K  [SMD_RESISTOR]
R133  Res2  value 10K  [SMD_RESISTOR]
R134  Res2  value 10K  [SMD_RESISTOR]
R135  Res2  value 10K  [SMD_RESISTOR]
R136  Res2  value 10K  [SMD_RESISTOR]
R137  Res2  value 10K  [SMD_RESISTOR]
R138  Res2  value 10K  [SMD_RESISTOR]
R139  RK09LDUAL  [RK09L124A12]  (parts A,B of 2)
R140  value 5K  [PDB181K220K104B]
R?  value 5K  [PDB181K220K104B]
U7  OPA1664AIDR  [OPA1664AIDR]  (value not drawn)  (parts A,B of 4)
U8  OPA1664AIDR  [OPA1664AIDR]  (value not drawn)  (parts A,B,C,D of 4)
VR?#2  RK09L12D0A1W  [RK09L12D0A1W]

### Ports
LI (in), O1 (out), O2 (out), O3 (out), O4 (out), RI (in)

### Nets
+VCC: U7.4(V+) U8.4(V+)  [project net opamp1vcc]
AGND: R125.1 R126.1 R131.1 R132.1 R133.1 R134.1 R139.1 R139.4 U7.3(IN_A+) U7.5(IN_B+) U8.5(IN_B+) U8.12(IN_D+)
opamp7gnd: U7.11(V-) U8.11(V-)  [also labelled Opamp_COMMON]  [project net opamp1gnd]
Net2514-_3: R135.2 ; port O1
Net2514-_H4: R136.2 ; port O2
Net2514-_H5: R137.2 ; port O3
Net2514-_H6: R138.2 ; port O4
NetC56_1: C56.1 R127.2 U8.1(OUT_A) U8.2(IN_A-)
NetC56_2: C56.2 R131.2 R135.1
NetC57_1: C57.1 R128.2 U8.7(OUT_B)
NetC57_2: C57.2 R132.2 R136.1
NetC58_1: C58.1 R129.2 U8.8(OUT_C) U8.9(IN_C-)
NetC58_2: C58.2 R133.2 R137.1
NetC59_1: C59.1 R130.2 U8.14(OUT_D)
NetC59_2: C59.2 R134.2 R138.1
NetR117_2: R139.3 ; port LI
NetR118_2: R139.6 ; port RI
NetR125_2: R125.2 R140.S U7.1(OUT_A) U8.3(IN_A+)
NetR126_2: R126.2 R?.S U7.7(OUT_B) U8.10(IN_C+)
NetR127_1: R127.1 R128.1 U8.6(IN_B-)
NetR129_1: R129.1 R130.1 U8.13(IN_D-)
NetR139_2: R139.2 R140.A U7.2(IN_A-)
NetR139_5: R139.5 R?.A U7.6(IN_B-)

Not connected (* = marked no-connect by the designer): R140 E; R? E

### Library data of the parts
C56-C59 = Cap Pol1: Polarized Capacitor (Radial); Published: 8-Jun-2000; LatestRevisionDate: 17-Jul-2002; LatestRevisionNote: Re-released for DXP Platform.; PackageReference: RB7.6-15; Publisher: Altium Limited; PackageDescription: Polarized Capacitor (Radial); 2 Leads
R125-R138 = Res2: Resistor; Published: 8-Jun-2000; LatestRevisionDate: 17-Jul-2002; LatestRevisionNote: Re-released for DXP Platform.; PackageReference: AXIAL-0.4; Publisher: Altium Limited; PackageDescription: Axial Device, Thru-Hole; 2 Leads; 0.4 in Pin Spacing
R139 = RK09LDUAL: GateName_1: G$1; SymbolName_1: POT_EU-; GateName_2: G$2; SymbolName_2: POT_EU-; LibraryName: SD_Pots; DeviceSetName: RK09LDUAL
R140 R? = TRIM_EU-CA6V: POTENTIOMETER; GateName_1: 1; SymbolName_1: TPOT; DeviceName: CA6V; LibraryName: pot; DeviceSetName: TRIM_EU-
U7 U8 = CMP-0272-00211-3: as 2 on sheet schema; Code_JEDEC: MS-012; PartNumber: OPA1664AIDR; ComponentLink2Description: Datasheet; ComponentLink3URL: http://www.ti.com/lit/ml/mpds177g/mpds177g.pdf; PackageVersion: 4040047-5/M, 06/2011; ComponentLink1Description: Manufacturer URL; DatasheetVersion: SBOS489; Mounting Technology: Surface Mount; Vio (25C)(Max)(mV): 1.5; PackageReference: D0014A; ComponentLink1URL: http://www.ti.com/; ComponentLink2URL: http://www.ti.com/lit/ds/symlink/opa1664.pdf; Eco-Plan: Green (RoHS & no Sb/Br); PackageDescription: 14-Pin Plastic Small Outline, Body 8.65 x 3.9 mm, Pitch 1.27 mm; ComponentLink3Description: Package Specification
VR?#2 = RK09L12D0A1W: Variable Resistor; Manufacturer_Name: ALPS; Datasheet Link: https://componentsearchengine.com/Datasheets/1/RK09L12D0A1W.pdf; Height: 25mm; Mouser2 Part Number: 688-RK09L12D0A1W; Mouser2 Price/Stock: https://www.mouser.com/Search/Refine.aspx?Keyword=688-RK09L12D0A1W; Manufacturer_Part_Number: RK09L12D0A1W

## Nets that join several sheets
AGND: Sheet4 (U?.OUT), schema (28 pins), schema1 (U4.3 U4.5 U4.10 U4.12), schema2 (12 pins), schema3 (12 pins)
opamp1gnd: Sheet4 (12 pins), schema (2.4 U1.4 U2.4 U3.11), schema1 (U4.11), schema2 (U5.11 U6.11), schema3 (U7.11 U8.11)
opamp1vcc: Sheet4 (11 pins), schema (2.11 U1.11 U2.11 U3.4), schema1 (U4.4), schema2 (U5.4 U6.4), schema3 (U7.4 U8.4)
Net2514-_3: Sheet4 (2514-.3), schema3 (R135.2)
Net2514-_H4: Sheet4 (2514-.H4), schema3 (R136.2)
Net2514-_H5: Sheet4 (2514-.H5), schema3 (R137.2)
Net2514-_H6: Sheet4 (2514-.H6), schema3 (R138.2)
Net2514-_H7: Sheet4 (2514-.H7), schema (C5.1)
Net2514-_H8: Sheet4 (2514-.H8), schema (C9.1)
Net2514-_H9: Sheet4 (2514-.H9), schema (C8.1)
Net2514-_H10: Sheet4 (2514-.H10), schema (C7.1)
Net2514-_H11: Sheet4 (2514-.H11), schema (C3.1)
Net2514-_H12: Sheet4 (2514-.H12), schema (C6.1)
Net2514-_H13: Sheet4 (2514-.H13), schema (C4.1)
Net2514-_H14: Sheet4 (2514-.H14), schema (C2.1)
NetR53_2: schema (R53.2), schema1 (R57.1 R58.1 R59.1)
NetR54_2: schema (R54.2), schema1 (R60.1 R61.1 R62.1)
NetR55_2: schema (R55.2), schema1 (R63.1 R64.1 R65.1)
NetR56_2: schema (R56.2), schema1 (R66.1 R67.1 R68.1)
NetR85_2: schema1 (R85.2 R86.2 R87.2 U4.1), schema2 (R97.1 R98.1)
NetR88_2: schema1 (R88.2 R89.2 R90.2 U4.7), schema2 (R99.1 R100.1)
NetR91_2: schema1 (R91.2 R92.2 R93.2 U4.8), schema2 (R101.1 R102.1)
NetR94_2: schema1 (R94.2 R95.2 R96.2 U4.14), schema2 (R103.1 R104.1)
NetR117_2: schema2 (R117.2 R119.2 R121.2 R123.2), schema3 (R139.3)
NetR118_2: schema2 (R118.2 R120.2 R122.2 R124.2), schema3 (R139.6)